# Altium schematic sheet FT8132-双电阻FOCV3.9_20250602.SCHDOC
size A4; Organization: Altium Limited; Address1: L3, 12a Rodborough Rd; Address2: Frenchs Forest; Address3: NSW; Address4: Australia 2086
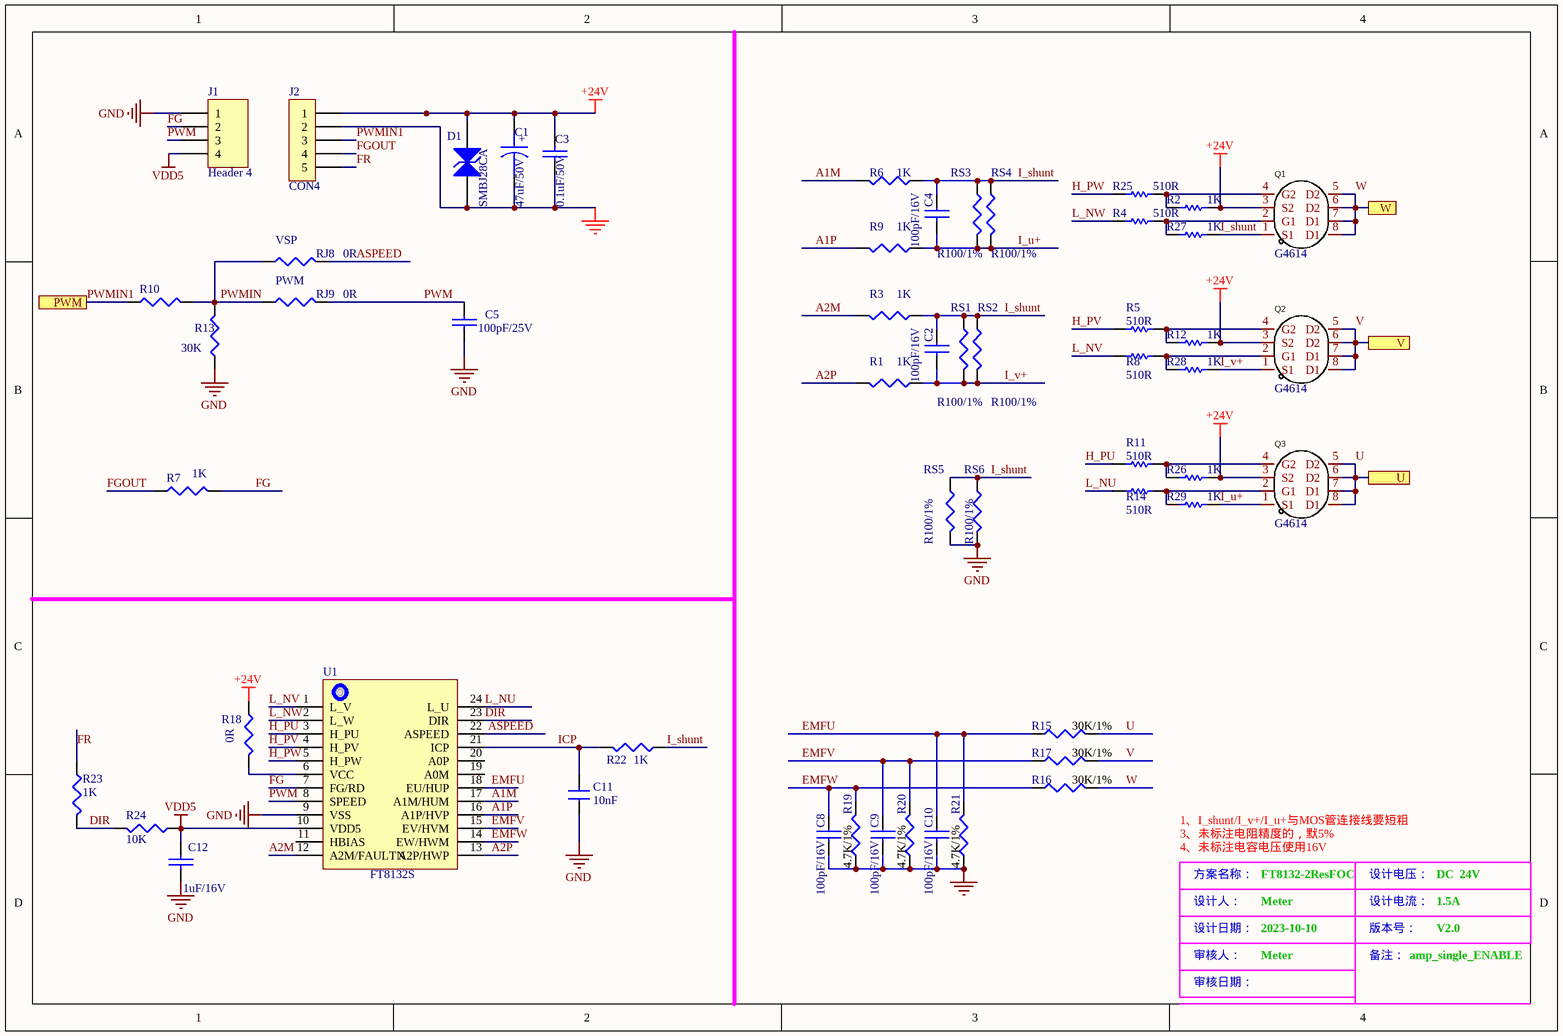
[diagram p0: FT8132-双电阻FOCV3.9_20250602.SCHDOC]

## Parts
C1  47uF/50V  [CAP-6.6X6.6X5.5]
C2  100pF/16V  [C0603]
C3  0.1uF/50V  [C0603]
C4  100pF/16V  [C0603]
C5  100pF/25V  [C0603]
C8  100pF/16V  [C0603]
C9  100pF/16V  [C0603]
C10  100pF/16V  [C0603]
C11  10nF  [C0603]
C12  1uF/16V  [C0603]
D1  SMBJ28CA  [SOD-123]
J1  Header 4  [HDR1X4]
J2  CON4  [XH4/2.54mm/90]
Q1  G4614  [SO-8]
Q2  G4614  [SO-8]
Q3  G4614  [SO-8]
R1  1K  [R0603]
R2  1K  [R0603]
R3  1K  [R0603]
R4  510R  [R0603]
R5  510R  [R0603]
R6  1K  [R0603]
R7  1K  [R0603]  (value not drawn)
R8  510R  [R0603]
R9  1K  [R0603]
R10  1K  [R0603]  (value not drawn)
R11  510R  [R0603]
R12  1K  [R0603]
R13  30K  [R0603]
R14  510R  [R0603]
R15  30K/1%  [R0603]
R16  30K/1%  [R0603]
R17  30K/1%  [R0603]
R18  0R  [R0603]
R19  4.7K/1%  [R0603]
R20  4.7K/1%  [R0603]
R21  4.7K/1%  [R0603]
R22  1K  [R0603]
R23  1K  [R0603]
R24  10K  [R0603]
R25  510R  [R0603]
R26  1K  [R0603]
R27  1K  [R0603]
R28  1K  [R0603]
R29  1K  [R0603]
RJ8  0R  [R0603]
RJ9  0R  [R0603]
RS1  R100/1%  [R1206]
RS2  R100/1%  [R1206]
RS3  R100/1%  [R1206]
RS4  R100/1%  [R1206]
RS5  R100/1%  [R1206]
RS6  R100/1%  [R1206]
U1  FT8132S  [SSOP24]

## Ports
PWM, U, V, W

## Nets
+24V: C1.1 C3.1 D1.2(K) J2.1 Q1.3(S2) Q2.3(S2) Q3.3(S2) R2.2 R12.2 R18.1 R26.2
GND: C1.2 C3.2 C5.2 C8.2 C9.2 C10.2 C11.1 C12.1 D1.1(A) J1.1 J2.2 R13.1 R19.1 R20.1 R21.1 RS5.2 RS6.2 U1.9(VSS)
VDD5: C12.2 J1.4 R24.1 U1.10(VDD5)
A1M: R6.2 U1.17(A1M/HUM)
A1P: R9.2 U1.16(A1P/HVP)
A2M: R3.2 U1.12(A2M/FAULTN)
A2P: R1.2 U1.13(A2P/HWP)
ASPEED: RJ8.2 U1.22(ASPEED)
DIR: R23.2 R24.2 U1.23(DIR)
EMFU: C10.1 R15.1 R21.2 U1.18(EU/HUP)
EMFV: C9.1 R17.1 R20.2 U1.15(EV/HVM)
EMFW: C8.1 R16.1 R19.2 U1.14(EW/HWM)
FG: J1.2 R7.2 U1.7(FG/RD)
FGOUT: J2.4 R7.1
FR: J2.5 R23.1
H_PU: R11.1 U1.3(H_PU)
H_PV: R5.1 U1.4(H_PV)
H_PW: R25.1 U1.5(H_PW)
I_shunt: C2.1 C4.1 Q1.1(S1) R3.1 R6.1 R22.1 R27.2 RS1.1 RS2.1 RS3.1 RS4.1 RS5.1 RS6.1
I_u+: C4.2 Q3.1(S1) R9.1 R29.2 RS3.2 RS4.2
I_v+: C2.2 Q2.1(S1) R1.1 R28.2 RS1.2 RS2.2
ICP: C11.2 R22.2 U1.21(ICP)
L_NU: R14.1 U1.24(L_U)
L_NV: R8.1 U1.1(L_V)
L_NW: R4.1 U1.2(L_W)
PWM: C5.1 J1.3 RJ9.2 U1.8(SPEED)
PWMIN: R10.2 R13.2 RJ8.1 RJ9.1
PWMIN1: J2.3 R10.1 ; port PWM
U: Q3.5(D2) Q3.6(D2) Q3.7(D1) Q3.8(D1) R15.2 ; port U
V: Q2.5(D2) Q2.6(D2) Q2.7(D1) Q2.8(D1) R17.2 ; port V
W: Q1.5(D2) Q1.6(D2) Q1.7(D1) Q1.8(D1) R16.2 ; port W
NetQ1_2: Q1.2(G1) R4.2 R27.1
NetQ1_4: Q1.4(G2) R2.1 R25.2
NetQ2_2: Q2.2(G1) R8.2 R28.1
NetQ2_4: Q2.4(G2) R5.2 R12.1
NetQ3_2: Q3.2(G1) R14.2 R29.1
NetQ3_4: Q3.4(G2) R11.2 R26.1
NetR18_2: R18.2 U1.6(VCC)

Not connected (* = marked no-connect by the designer): U1 11(HBIAS) 19(A0M) 20(A0P)

## Notes on the sheet
- (near RJ8) VSP
- PWM
- (near R7) 1K
- 3、未标注电阻精度的，默5%
- 1、I_shunt/I_v+/I_u+与MOS管连接线要短粗
- 4、未标注电容电压使用16V
- 方案名称：
- 设计人：
- FT8132-2ResFOC
- Meter
- 设计电压：
- 设计电流：
- DC  24V
- 1.5A
- 设计日期：
- 审核人：
- 审核日期：
- 2023-10-10
- 版本号：
- 备注：
- amp_single_ENABLE
- V2.0
- Title
- Size:
- Date:
- A4
- Number:
- Time:
- Revision:
- Sheet
- of
- File:
- (in symbol CAPACITOR POL) +

## Library data of the parts
C1 = CAPACITOR POL: Capacitor
C2 C4 C8-C10 = CAP NP: Text Field1: 20; Text Field2: 10
C3 C5 C11 = CAP: Capacitor
C12 = CAP-CC: Capacitor
D1 = SMB/DO-214AA P6SMB6.8CA: TVS; ComponentLink1Description: 供应商链接; ComponentLink1URL: http://www.szlcsc.com/product/details_79530.html; Package: SMB/DO-214AA; Supplier: LC; SuppliersPartNumber: C78395
J1 = Header 4: Header, 4-Pin; LatestRevisionDate: 17-Jul-2002; LatestRevisionNote: Re-released for DXP Platform.; Publisher: Altium Limited
J2 = VH5
Q1-Q3 = G4614: Add into BOM: yes; Name: G4614; Symbol: G4614; Device: G4614; LCSC Part Name: G4614; Supplier Part: C7465424; Manufacturer Part: G4614; Supplier Footprint: SOP-8; Datasheet: https://atta.szlcsc.com/upload/public/pdf/source/20230719/26D75AFD91122D699FFA118337651D12.pdf; Supplier: LCSC; Convert to PCB: yes
R1 R3 R6 R7 R9 R10 R13 R15-R24 RJ8 RJ9 RS1-RS6 = RES(SMD)
R2 R4 R5 R8 R11 R12 R14 R25-R29 = RES
U1 = FT8131S: FT8131Q SSOP24